# EAGLE design f4mpac_adapter (EAGLE 7.5.0)
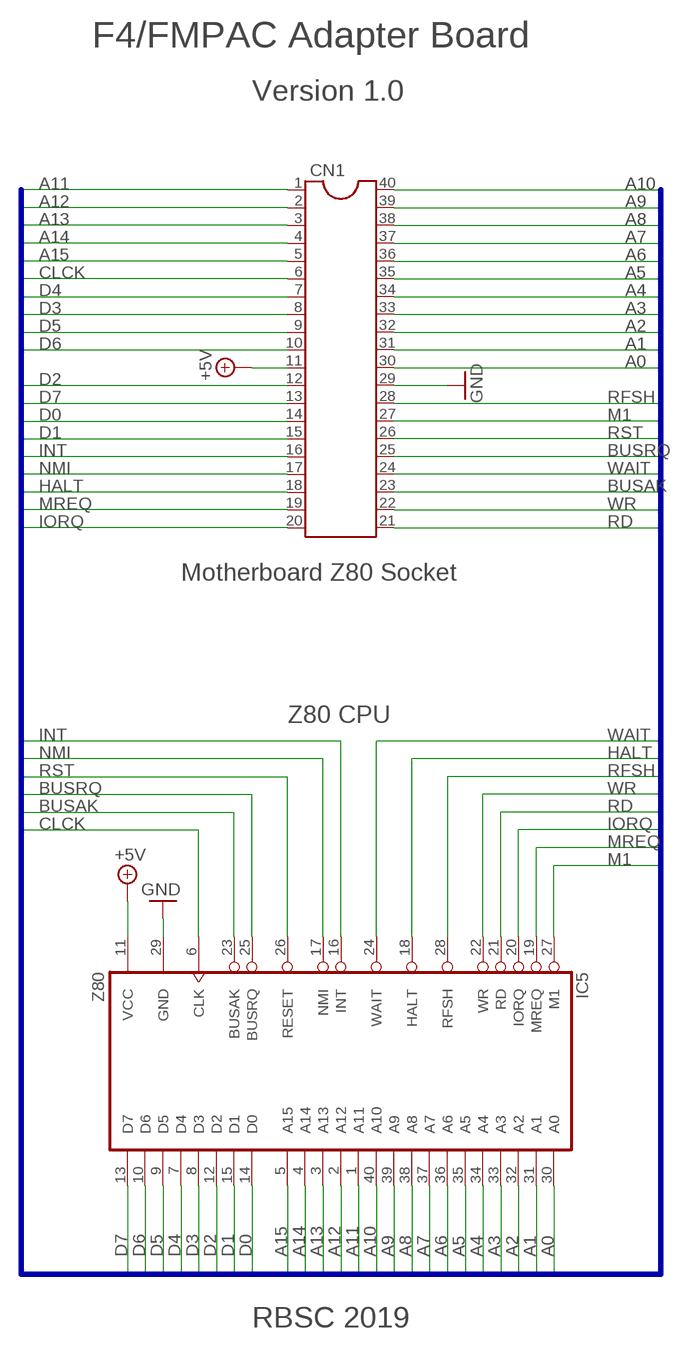
[diagram p0: schematic, sheet 1]

## Parts
CN1  DIP40 MB CONN  DIL40  [DIL40]
IC5  Z80  Z80CPU  [DIL40]

## Nets
+5V: CN1.11 IC5.11(VCC)
A0: CN1.30 IC5.30(A0)
A1: CN1.31 IC5.31(A1)
A2: CN1.32 IC5.32(A2)
A3: CN1.33 IC5.33(A3)
A4: CN1.34 IC5.34(A4)
A5: CN1.35 IC5.35(A5)
A6: CN1.36 IC5.36(A6)
A7: CN1.37 IC5.37(A7)
A8: CN1.38 IC5.38(A8)
A9: CN1.39 IC5.39(A9)
A10: CN1.40 IC5.40(A10)
A11: CN1.1 IC5.1(A11)
A12: CN1.2 IC5.2(A12)
A13: CN1.3 IC5.3(A13)
A14: CN1.4 IC5.4(A14)
A15: CN1.5 IC5.5(A15)
BUSAK: CN1.23 IC5.23(BUSAK)
BUSRQ: CN1.25 IC5.25(BUSRQ)
CLCK: CN1.6 IC5.6(CLK)
D0: CN1.14 IC5.14(D0)
D1: CN1.15 IC5.15(D1)
D2: CN1.12 IC5.12(D2)
D3: CN1.8 IC5.8(D3)
D4: CN1.7 IC5.7(D4)
D5: CN1.9 IC5.9(D5)
D6: CN1.10 IC5.10(D6)
D7: CN1.13 IC5.13(D7)
GND: CN1.29 IC5.29(GND)
HALT: CN1.18 IC5.18(HALT)
INT: CN1.16 IC5.16(INT)
IORQ: CN1.20 IC5.20(IORQ)
M1: CN1.27 IC5.27(M1)
MREQ: CN1.19 IC5.19(MREQ)
NMI: CN1.17 IC5.17(NMI)
RD: CN1.21 IC5.21(RD)
RFSH: CN1.28 IC5.28(RFSH)
RST: CN1.26 IC5.26(RESET)
WAIT: CN1.24 IC5.24(WAIT)
WR: CN1.22 IC5.22(WR)

## Buses
A0,A1,A2,A3,A4,A5,A6,A7,A8,A9,A10,A11,A12,A13,A14,A15,D0,D1,D2,D3,D4,D5,D6,D7,IORQ,RD,WR,M1,CLCK,RST,RFSH,BUSRQ,WAIT,BUSAK,MREQ,HALT,INT,NMI

## Notes on the sheet
- F4/FMPAC Adapter Board
- Version 1.0
- Motherboard Z80 Socket
- Z80 CPU
- RBSC 2019

## Library data of the parts
CN1 = ic-package:DIL40: Dual In Line
IC5 = zilog:Z80CPU: Z80 FAMILY DEVICE

## Board
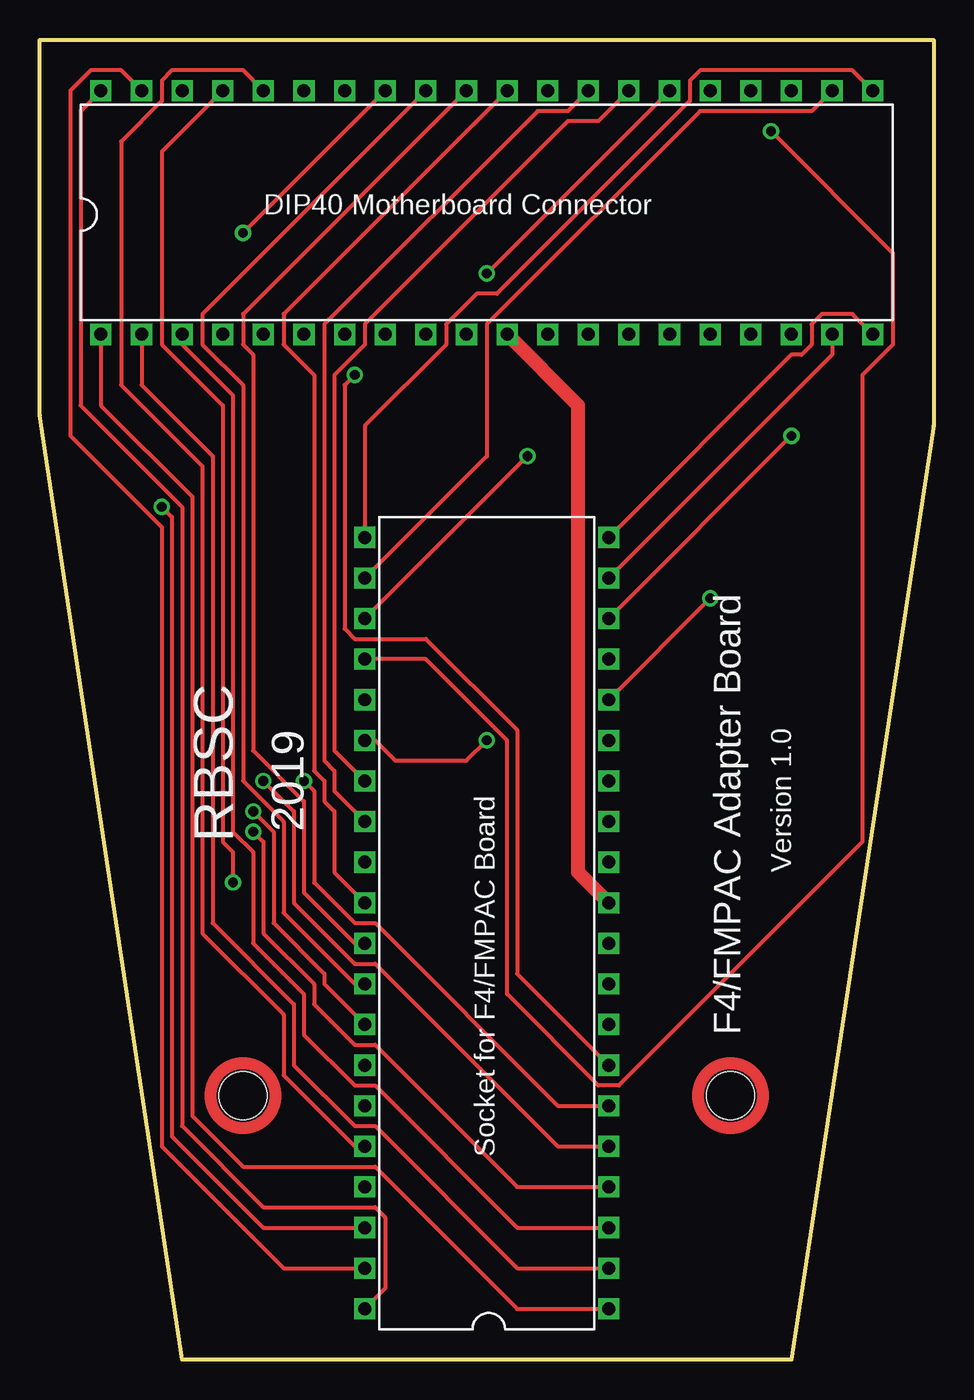
[diagram p1: board, top side]
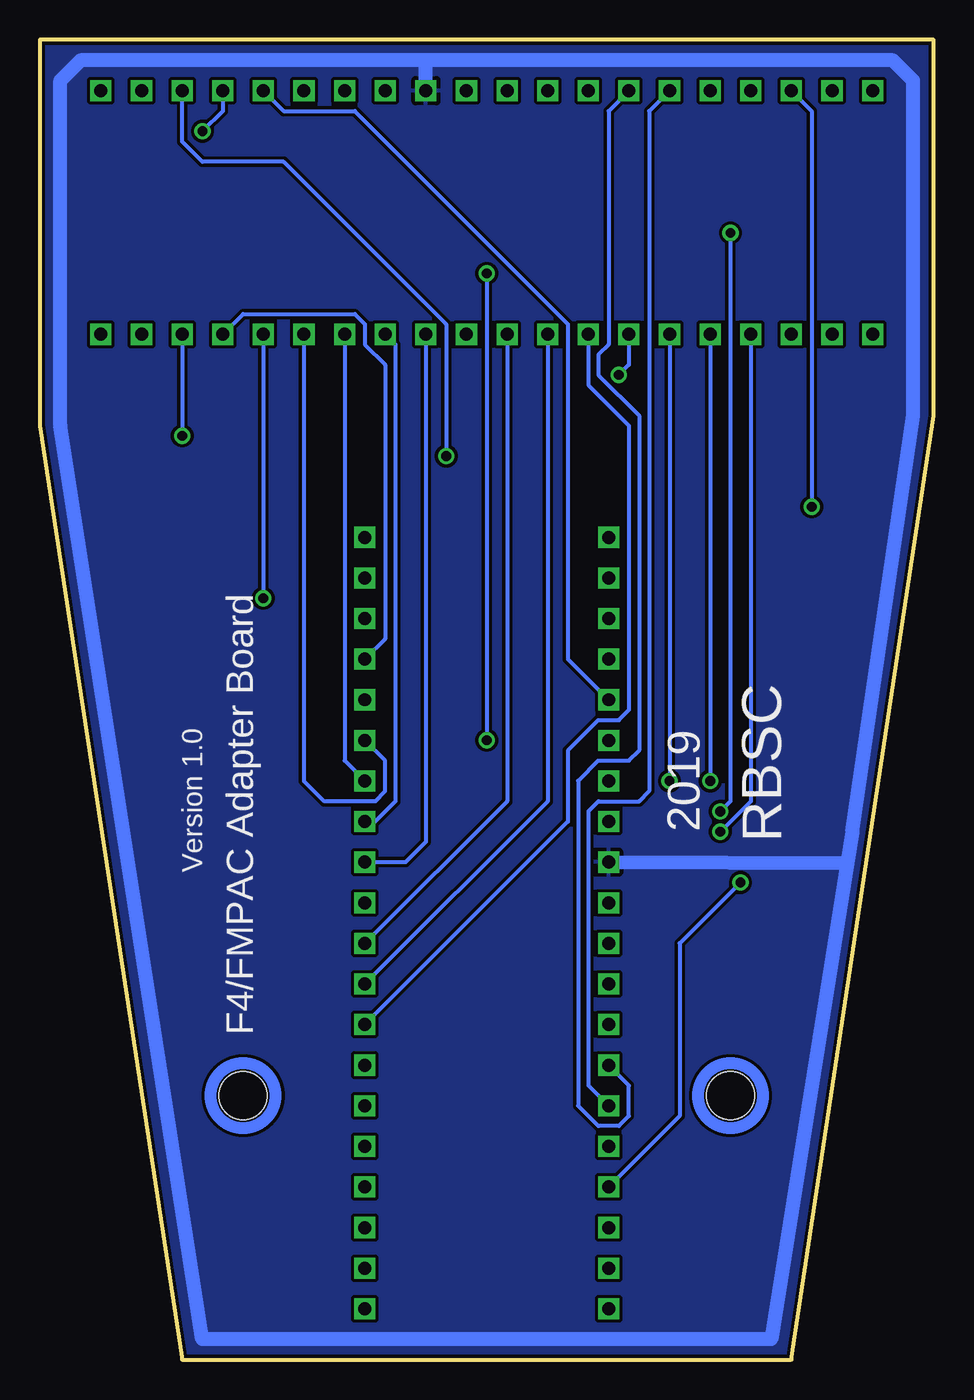
[diagram p2: board, bottom side, seen from below]

Size 55.88 x 82.55 mm. Coordinates in mm from the lower left corner, seen from the top.
Outline: 55.88,82.55 55.88,81.91
Outline: 55.88,82.55 0,82.55 0,59.05 8.89,0 46.99,0 55.88,58.42 55.88,82.55
Copper layers (1*16): Top 0.035mm / dielectric 1.5mm / Bottom 0.035mm
Design rules "default *": minimum track width 10mil, minimum drill 24mil, track to track 8mil, track to pad 8mil, pad to pad 8mil, via to via 8mil, smd to smd 8mil, copper to edge 8mil, drill to drill 8mil, minimum pad ring 10mil, minimum via ring 8mil, stop-mask expansion 4mil, vias tented up to drill 24mil, thermal gap 10mil
Holes 3 mm at 12.7,16.51 43.18,16.51

### Footprints (pad centres in the part's own frame; a part is rotated, then mirrored left to right if it is on the bottom)
DIL40 = drill 0.813 square: 1 -24.13,-7.62; 2 -21.59,-7.62; 3 -19.05,-7.62; 4 -16.51,-7.62; 5 -13.97,-7.62; 6 -11.43,-7.62; 7 -8.89,-7.62; 8 -6.35,-7.62; 9 -3.81,-7.62; 10 -1.27,-7.62; 11 1.27,-7.62; 12 3.81,-7.62; 13 6.35,-7.62; 14 8.89,-7.62; 15 11.43,-7.62; 16 13.97,-7.62; 17 16.51,-7.62; 18 19.05,-7.62; 19 21.59,-7.62; 20 24.13,-7.62; 21 24.13,7.62; 22 21.59,7.62; 23 19.05,7.62; 24 16.51,7.62; 25 13.97,7.62; 26 11.43,7.62; 27 8.89,7.62; 28 6.35,7.62; 29 3.81,7.62; 30 1.27,7.62; 31 -1.27,7.62; 32 -3.81,7.62; 33 -6.35,7.62; 34 -8.89,7.62; 35 -11.43,7.62; 36 -13.97,7.62; 37 -16.51,7.62; 38 -19.05,7.62; 39 -21.59,7.62; 40 -24.13,7.62

### Placement (x,y rotation side)
CN1  27.94,71.75 0 top
IC5  27.94,27.3 90 top

### Tracks (layer width: path | path; a pad name or v marks a point on that pad's centre or on a via)
+5V
  Top 0.889: IC5.11 33.66,30.48 33.66,59.69 CN1.11
A0
  Top 0.254: IC5.30 18.41,30.48 18.41,34.29 17.78,34.93 17.78,36.2 17.14,36.83 17.14,61.59 15.24,63.5 15.24,65.41 CN1.30
A1
  Top 0.254: IC5.31 19.68,26.04 16.51,29.21 16.51,34.93 13.34,38.1 13.34,62.87 12.7,63.5 12.7,65.41 CN1.31
A2
  Top 0.254: IC5.32 19.68,23.49 15.24,27.94 15.24,33.66 12.7,36.2 12.7,60.96 10.16,63.5 10.16,65.41 CN1.32
A3  (via drill 0.61)
  Top 0.254: IC5.33 17.78,23.49 17.78,24.13 14.61,27.3 14.61,33.02 v13.34,34.29 | CN1.33 v12.7,70.48
  Bottom 0.254: v13.34,34.29 12.7,34.93 v12.7,70.48
A4
  Bottom 0.254: IC5.34 19.05,17.14 19.05,15.24 19.68,14.61 20.95,14.61 22.23,15.88 22.23,36.2 20.95,37.47 19.05,37.47 18.41,38.1 18.41,59.05 20.95,61.59 20.95,62.87 20.32,63.5 20.32,78.1 CN1.34
A5
  Bottom 0.254: IC5.35 21.59,17.14 21.59,34.29 20.95,34.93 18.41,34.93 17.78,35.56 17.78,78.1 CN1.35
A6
  Top 0.254: IC5.36 19.68,13.34 15.24,17.78 15.24,21.59 10.16,26.67 10.16,55.88 5.08,60.96 5.08,76.2 7.62,78.74 7.62,80.01 8.26,80.64 12.7,80.64 CN1.36
A7  (via drill 0.61)
  Top 0.254: v12.06,29.84 12.06,31.75 11.43,32.39 11.43,59.69 7.62,63.5 7.62,75.56 CN1.37
  Bottom 0.254: IC5.37 15.88,15.24 15.88,26.04 v12.06,29.84
A8  (via drill 0.61)
  Top 0.254: IC5.38 13.97,8.26 8.26,13.97 8.26,52.71 v7.62,53.34
  Bottom 0.254: v7.62,53.34 7.62,78.1 CN1.38
A9
  Top 0.254: IC5.39 15.24,5.71 7.62,13.34 7.62,52.07 1.91,57.79 1.91,79.38 3.17,80.64 5.08,80.64 CN1.39
A10
  Top 0.254: IC5.40 21.59,4.45 21.59,8.89 20.95,9.53 13.97,9.53 8.89,14.61 8.89,53.34 2.54,59.69 2.54,78.1 CN1.40
A11
  Top 0.254: IC5.1 29.84,3.17 20.95,12.06 12.7,12.06 9.53,15.24 9.53,53.98 3.81,59.69 CN1.1
A12
  Top 0.254: IC5.2 29.84,5.71 20.95,14.61 19.68,14.61 15.88,18.41 15.88,22.22 10.79,27.3 10.79,56.52 6.35,60.96 CN1.2
A13
  Top 0.254: IC5.3 29.84,8.26 20.95,17.14 19.68,17.14 16.51,20.32 16.51,22.86 13.34,26.04 13.34,31.75 12.06,33.02 12.06,60.33 8.89,63.5 CN1.3
A14  (via drill 0.61)
  Top 0.254: IC5.4 29.84,10.79 20.95,19.68 19.68,19.68 17.14,22.22 17.14,23.49 13.97,26.67 13.97,32.39 v13.34,33.02
  Bottom 0.254: v13.34,33.02 11.43,34.93 CN1.4
A15  (via drill 0.61)
  Top 0.254: IC5.5 32.38,13.34 20.95,24.76 19.68,24.76 15.88,28.57 15.88,34.29 v13.97,36.2
  Bottom 0.254: CN1.5 v13.97,36.2
BUSAK  (via drill 0.61)
  Top 0.254: v30.48,56.52 IC5.23
  Bottom 0.254: v30.48,56.52 30.48,64.77 40.64,74.93 45.72,74.93 46.99,76.2 CN1.23
BUSRQ
  Bottom 0.254: IC5.25 22.86,43.82 22.86,64.77 36.2,78.1 40.64,78.1 CN1.25
CLCK  (via drill 0.61)
  Top 0.254: IC5.6 32.38,15.88 20.95,27.3 19.68,27.3 17.14,29.84 17.14,35.56 v16.51,36.2
  Bottom 0.254: CN1.6 v16.51,36.2
D0
  Bottom 0.254: IC5.14 36.83,37.47 CN1.14
D1
  Bottom 0.254: IC5.15 34.29,37.47 34.29,35.56 34.92,34.93 38.1,34.93 39.37,36.2 CN1.15
D2
  Bottom 0.254: CN1.12 31.75,32.39 33.02,31.11 IC5.12
D3
  Bottom 0.254: IC5.8 22.86,33.66 22.86,38.1 20.95,40.01 19.68,40.01 19.05,40.64 19.05,58.42 21.59,60.96 CN1.8
D4  (via drill 0.61)
  Top 0.254: IC5.7 29.84,24.13 29.84,39.37 24.13,45.09 19.68,45.09 19.05,45.72 19.05,60.96 v19.68,61.59
  Bottom 0.254: v19.68,61.59 19.05,62.23 CN1.7
D5
  Bottom 0.254: IC5.9 24.13,34.93 CN1.9
D6
  Bottom 0.254: IC5.10 26.67,34.93 CN1.10
D7
  Bottom 0.254: CN1.13 33.66,63.5 33.66,34.93 34.92,33.66 IC5.13
GND
  Bottom 0.889: 31.75,81.28 2.54,81.28 1.27,80.01 1.27,59.05 5.08,33.02 5.39,31.06 | 31.75,81.28 53.34,81.28 54.61,80.01 54.61,58.42 45.72,1.27 10.16,1.27 5.39,31.06 | CN1.29 31.75,81.28 | IC5.29 5.39,31.06
  pour Bottom: 0,82.55 0,59.05 8.89,0 46.99,0 55.88,58.42 55.88,82.55
HALT  (via drill 0.61)
  Top 0.254: v46.99,57.79 IC5.18
  Bottom 0.254: CN1.18 v46.99,57.79
INT  (via drill 0.61)
  Top 0.254: v41.91,47.62 IC5.16
  Bottom 0.254: CN1.16 v41.91,47.62
IORQ
  Top 0.254: IC5.20 46.99,62.87 47.62,62.87 48.26,63.5 48.26,64.77 48.9,65.41 50.8,65.41 CN1.20
M1
  Top 0.254: IC5.27 18.41,38.1 18.41,61.59 20.32,63.5 20.32,64.77 33.02,77.47 34.92,77.47 CN1.27
MREQ
  Top 0.254: IC5.19 49.53,62.87 CN1.19
NMI
  Bottom 0.254: IC5.17 34.29,45.09 34.29,62.23 35.56,63.5 35.56,64.77 36.2,65.41 43.18,65.41 CN1.17
RD
  Top 0.254: IC5.21 20.32,58.42 25.4,63.5 25.4,64.77 27.3,66.67 28.57,66.67 40.64,78.74 40.64,80.01 41.27,80.64 50.8,80.64 CN1.21
RFSH
  Top 0.254: IC5.28 18.41,35.56 18.41,36.83 17.78,37.47 17.78,64.77 31.11,78.1 33.02,78.1 CN1.28
RST  (via drill 0.61)
  Top 0.254: CN1.26 v27.94,67.94 | IC5.26 20.95,38.73 22.23,37.47 26.67,37.47 v27.94,38.73
  Bottom 0.254: v27.94,67.94 v27.94,38.73
WAIT  (via drill 0.61)
  Top 0.254: IC5.24 24.13,43.82 29.21,38.73 29.21,22.86 34.92,17.14 36.2,17.14 51.44,32.39 51.44,61.59 53.34,63.5 53.34,69.21 v45.72,76.83
  Bottom 0.254: v45.72,76.83 44.45,78.1 CN1.24
WR
  Top 0.254: IC5.22 27.94,56.52 27.94,64.77 41.27,78.1 48.26,78.1 CN1.22
(copper drawn outside any net)
  shapes: Bottom circle x2, Top circle x2

### Text on the board
tNames: DIP40 Motherboard Connector | 2019 | RBSC | Version 1.0 | F4/FMPAC Adapter Board | Socket for F4/FMPAC Board
bNames: 2019 | RBSC | Version 1.0 | F4/FMPAC Adapter Board